# EAGLE design Tablero_Potencia (EAGLE 9.6.2)
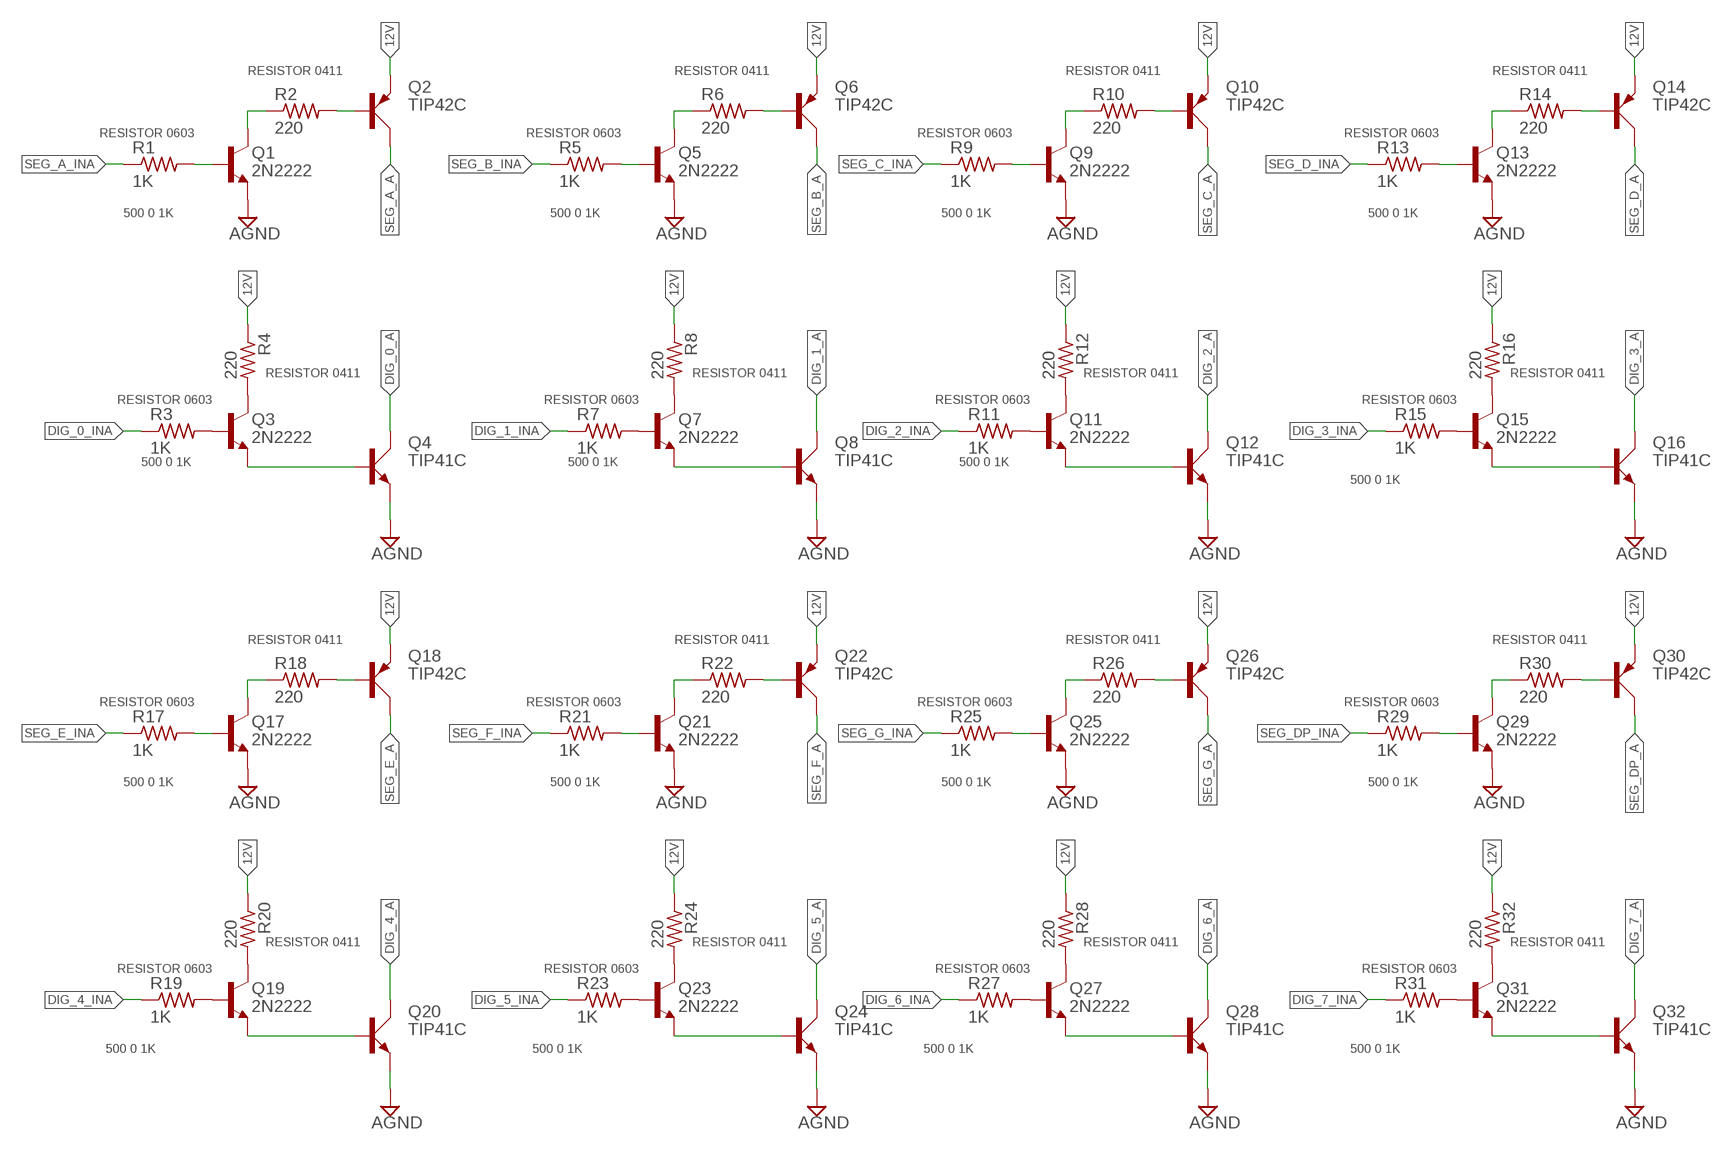
[diagram p0: schematic, sheet 1, part 1 of 2]
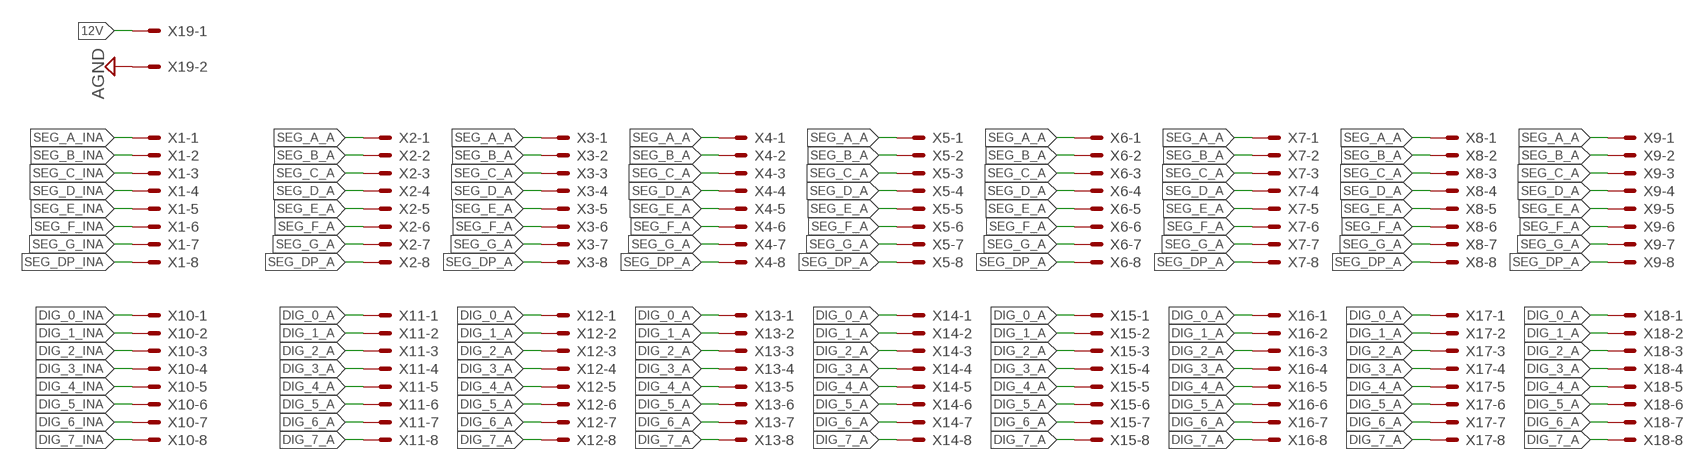
[diagram p1: schematic, sheet 1, part 2 of 2]

## Parts
Q1  2N2222  BJT-NPNTO92  [TO92]
Q2  TIP42C  [TO220AV]
Q3  2N2222  BJT-NPNTO92  [TO92]
Q4  TIP41C  [TO220AV]
Q5  2N2222  BJT-NPNTO92  [TO92]
Q6  TIP42C  [TO220AV]
Q7  2N2222  BJT-NPNTO92  [TO92]
Q8  TIP41C  [TO220AV]
Q9  2N2222  BJT-NPNTO92  [TO92]
Q10  TIP42C  [TO220AV]
Q11  2N2222  BJT-NPNTO92  [TO92]
Q12  TIP41C  [TO220AV]
Q13  2N2222  BJT-NPNTO92  [TO92]
Q14  TIP42C  [TO220AV]
Q15  2N2222  BJT-NPNTO92  [TO92]
Q16  TIP41C  [TO220AV]
Q17  2N2222  BJT-NPNTO92  [TO92]
Q18  TIP42C  [TO220AV]
Q19  2N2222  BJT-NPNTO92  [TO92]
Q20  TIP41C  [TO220AV]
Q21  2N2222  BJT-NPNTO92  [TO92]
Q22  TIP42C  [TO220AV]
Q23  2N2222  BJT-NPNTO92  [TO92]
Q24  TIP41C  [TO220AV]
Q25  2N2222  BJT-NPNTO92  [TO92]
Q26  TIP42C  [TO220AV]
Q27  2N2222  BJT-NPNTO92  [TO92]
Q28  TIP41C  [TO220AV]
Q29  2N2222  BJT-NPNTO92  [TO92]
Q30  TIP42C  [TO220AV]
Q31  2N2222  BJT-NPNTO92  [TO92]
Q32  TIP41C  [TO220AV]
R1  1K  R-US_R0603  [R0603]
R2  220  R-US_0411/15  [0411/15]
R3  1K  R-US_R0603  [R0603]
R4  220  R-US_0411/15  [0411/15]
R5  1K  R-US_R0603  [R0603]
R6  220  R-US_0411/15  [0411/15]
R7  1K  R-US_R0603  [R0603]
R8  220  R-US_0411/15  [0411/15]
R9  1K  R-US_R0603  [R0603]
R10  220  R-US_0411/15  [0411/15]
R11  1K  R-US_R0603  [R0603]
R12  220  R-US_0411/15  [0411/15]
R13  1K  R-US_R0603  [R0603]
R14  220  R-US_0411/15  [0411/15]
R15  1K  R-US_R0603  [R0603]
R16  220  R-US_0411/15  [0411/15]
R17  1K  R-US_R0603  [R0603]
R18  220  R-US_0411/15  [0411/15]
R19  1K  R-US_R0603  [R0603]
R20  220  R-US_0411/15  [0411/15]
R21  1K  R-US_R0603  [R0603]
R22  220  R-US_0411/15  [0411/15]
R23  1K  R-US_R0603  [R0603]
R24  220  R-US_0411/15  [0411/15]
R25  1K  R-US_R0603  [R0603]
R26  220  R-US_0411/15  [0411/15]
R27  1K  R-US_R0603  [R0603]
R28  220  R-US_0411/15  [0411/15]
R29  1K  R-US_R0603  [R0603]
R30  220  R-US_0411/15  [0411/15]
R31  1K  R-US_R0603  [R0603]
R32  220  R-US_0411/15  [0411/15]
X1  KK-156-8  [KK-156-8]
X2  KK-156-8  [KK-156-8]
X3  KK-156-8  [KK-156-8]
X4  KK-156-8  [KK-156-8]
X5  KK-156-8  [KK-156-8]
X6  KK-156-8  [KK-156-8]
X7  KK-156-8  [KK-156-8]
X8  KK-156-8  [KK-156-8]
X9  KK-156-8  [KK-156-8]
X10  KK-156-8  [KK-156-8]
X11  KK-156-8  [KK-156-8]
X12  KK-156-8  [KK-156-8]
X13  KK-156-8  [KK-156-8]
X14  KK-156-8  [KK-156-8]
X15  KK-156-8  [KK-156-8]
X16  KK-156-8  [KK-156-8]
X17  KK-156-8  [KK-156-8]
X18  KK-156-8  [KK-156-8]
X19  KK-156-2  [KK-156-2]

## Nets
12V [12VV]: Q2.E Q6.E Q10.E Q14.E Q18.E Q22.E Q26.E Q30.E R4.1 R8.1 R12.1 R16.1 R20.1 R24.1 R28.1 R32.1 X19.1
AGND: Q1.3(E) Q4.E Q5.3(E) Q8.E Q9.3(E) Q12.E Q13.3(E) Q16.E Q17.3(E) Q20.E Q21.3(E) Q24.E Q25.3(E) Q28.E Q29.3(E) Q32.E X19.2
DIG_0_A [12V]: Q4.C X11.1 X12.1 X13.1 X14.1 X15.1 X16.1 X17.1 X18.1
DIG_0_INA: R3.1 X10.1
DIG_1_A [12V]: Q8.C X11.2 X12.2 X13.2 X14.2 X15.2 X16.2 X17.2 X18.2
DIG_1_INA: R7.1 X10.2
DIG_2_A [12V]: Q12.C X11.3 X12.3 X13.3 X14.3 X15.3 X16.3 X17.3 X18.3
DIG_2_INA: R11.1 X10.3
DIG_3_A [12V]: Q16.C X11.4 X12.4 X13.4 X14.4 X15.4 X16.4 X17.4 X18.4
DIG_3_INA: R15.1 X10.4
DIG_4_A [12V]: Q20.C X11.5 X12.5 X13.5 X14.5 X15.5 X16.5 X17.5 X18.5
DIG_4_INA: R19.1 X10.5
DIG_5_A [12V]: Q24.C X11.6 X12.6 X13.6 X14.6 X15.6 X16.6 X17.6 X18.6
DIG_5_INA: R23.1 X10.6
DIG_6_A [12V]: Q28.C X11.7 X12.7 X13.7 X14.7 X15.7 X16.7 X17.7 X18.7
DIG_6_INA: R27.1 X10.7
DIG_7_A [12V]: Q32.C X11.8 X12.8 X13.8 X14.8 X15.8 X16.8 X17.8 X18.8
DIG_7_INA: R31.1 X10.8
N$1: Q2.B R2.2
N$2: Q1.1(C) R2.1
N$3: Q3.1(C) R4.2
N$4: Q3.3(E) Q4.B
N$5: Q6.B R6.2
N$6: Q7.1(C) R8.2
N$7: Q7.3(E) Q8.B
N$8: Q5.1(C) R6.1
N$9: Q7.2(B) R7.2
N$10: Q5.2(B) R5.2
N$11: Q3.2(B) R3.2
N$12: Q1.2(B) R1.2
N$13: Q10.B R10.2
N$14: Q11.1(C) R12.2
N$15: Q11.3(E) Q12.B
N$16: Q9.1(C) R10.1
N$17: Q11.2(B) R11.2
N$18: Q9.2(B) R9.2
N$19: Q14.B R14.2
N$20: Q15.1(C) R16.2
N$21: Q15.3(E) Q16.B
N$22: Q13.1(C) R14.1
N$23: Q15.2(B) R15.2
N$24: Q13.2(B) R13.2
N$25: Q18.B R18.2
N$26: Q19.1(C) R20.2
N$27: Q19.3(E) Q20.B
N$28: Q17.1(C) R18.1
N$29: Q19.2(B) R19.2
N$30: Q17.2(B) R17.2
N$31: Q22.B R22.2
N$32: Q23.1(C) R24.2
N$33: Q23.3(E) Q24.B
N$34: Q21.1(C) R22.1
N$35: Q23.2(B) R23.2
N$36: Q21.2(B) R21.2
N$37: Q26.B R26.2
N$38: Q27.1(C) R28.2
N$39: Q27.3(E) Q28.B
N$40: Q25.1(C) R26.1
N$41: Q27.2(B) R27.2
N$42: Q25.2(B) R25.2
N$43: Q30.B R30.2
N$44: Q31.1(C) R32.2
N$45: Q31.3(E) Q32.B
N$46: Q29.1(C) R30.1
N$47: Q31.2(B) R31.2
N$48: Q29.2(B) R29.2
SEG_A_A [12V]: Q2.C X2.1 X3.1 X4.1 X5.1 X6.1 X7.1 X8.1 X9.1
SEG_A_INA: R1.1 X1.1
SEG_B_A [12V]: Q6.C X2.2 X3.2 X4.2 X5.2 X6.2 X7.2 X8.2 X9.2
SEG_B_INA: R5.1 X1.2
SEG_C_A [12V]: Q10.C X2.3 X3.3 X4.3 X5.3 X6.3 X7.3 X8.3 X9.3
SEG_C_INA: R9.1 X1.3
SEG_D_A [12V]: Q14.C X2.4 X3.4 X4.4 X5.4 X6.4 X7.4 X8.4 X9.4
SEG_D_INA: R13.1 X1.4
SEG_DP_A [12V]: Q30.C X2.8 X3.8 X4.8 X5.8 X6.8 X7.8 X8.8 X9.8
SEG_DP_INA: R29.1 X1.8
SEG_E_A [12V]: Q18.C X2.5 X3.5 X4.5 X5.5 X6.5 X7.5 X8.5 X9.5
SEG_E_INA: R17.1 X1.5
SEG_F_A [12V]: Q22.C X2.6 X3.6 X4.6 X5.6 X6.6 X7.6 X8.6 X9.6
SEG_F_INA: R21.1 X1.6
SEG_G_A [12V]: Q26.C X2.7 X3.7 X4.7 X5.7 X6.7 X7.7 X8.7 X9.7
SEG_G_INA: R25.1 X1.7

## Notes on the sheet
- RESISTOR 0411 | RESISTOR 0411 | RESISTOR 0411 | RESISTOR 0411
- RESISTOR 0603 | RESISTOR 0603 | RESISTOR 0603 | RESISTOR 0603
- 500 0 1K | 500 0 1K | 500 0 1K | 500 0 1K
- RESISTOR 0411 | RESISTOR 0411 | RESISTOR 0411 | RESISTOR 0411
- RESISTOR 0603 | RESISTOR 0603 | RESISTOR 0603 | RESISTOR 0603
- 500 0 1K | 500 0 1K | 500 0 1K
- 500 0 1K
- RESISTOR 0411 | RESISTOR 0411 | RESISTOR 0411 | RESISTOR 0411
- RESISTOR 0603 | RESISTOR 0603 | RESISTOR 0603 | RESISTOR 0603
- 500 0 1K | 500 0 1K | 500 0 1K | 500 0 1K
- RESISTOR 0411 | RESISTOR 0411 | RESISTOR 0411 | RESISTOR 0411
- RESISTOR 0603 | RESISTOR 0603 | RESISTOR 0603 | RESISTOR 0603
- 500 0 1K | 500 0 1K | 500 0 1K | 500 0 1K

## Library data of the parts
Q1 Q3 Q5 Q7 Q9 Q11 Q13 Q15 Q17 Q19 Q21 Q23 Q25 Q27 Q29 Q31 = bt_transistor:BJT-NPN: NPN Transistor Small signal NPN Bipolar Junction Transistor (BJT). Use this device to represent any of a number of such transistors with similar package and pinout: 2N4401, 2N3904, 2N2222, etc.
Q2 Q6 Q10 Q14 Q18 Q22 Q26 Q30 = transistor-power:TIP42C: PNP TRANSISTOR
Q4 Q8 Q12 Q16 Q20 Q24 Q28 Q32 = transistor-power:TIP41C: NPN TRANSISTOR
R1-R32 = rcl:R-US_: RESISTOR, American symbol; SPICEPREFIX: R
X1-X18 = con-molex:KK-156-8: KK 156 HEADER Source: http://www.molex.com/pdm_docs/sd/026604100_sd.pdf; MF: MOLEX; OC_FARNELL: unknown; OC_NEWARK: unknown
X19 = con-molex:KK-156-2: KK 156 HEADER Source: http://www.molex.com/pdm_docs/sd/026604100_sd.pdf; MF: MOLEX; OC_FARNELL: unknown; OC_NEWARK: unknown

## Net classes
0 default: width 0.3 mm, clearance 0.205 mm
1 12V: width 0.7 mm, clearance 0.5 mm
2 12VV: width 1 mm, clearance 0.45 mm

## Board
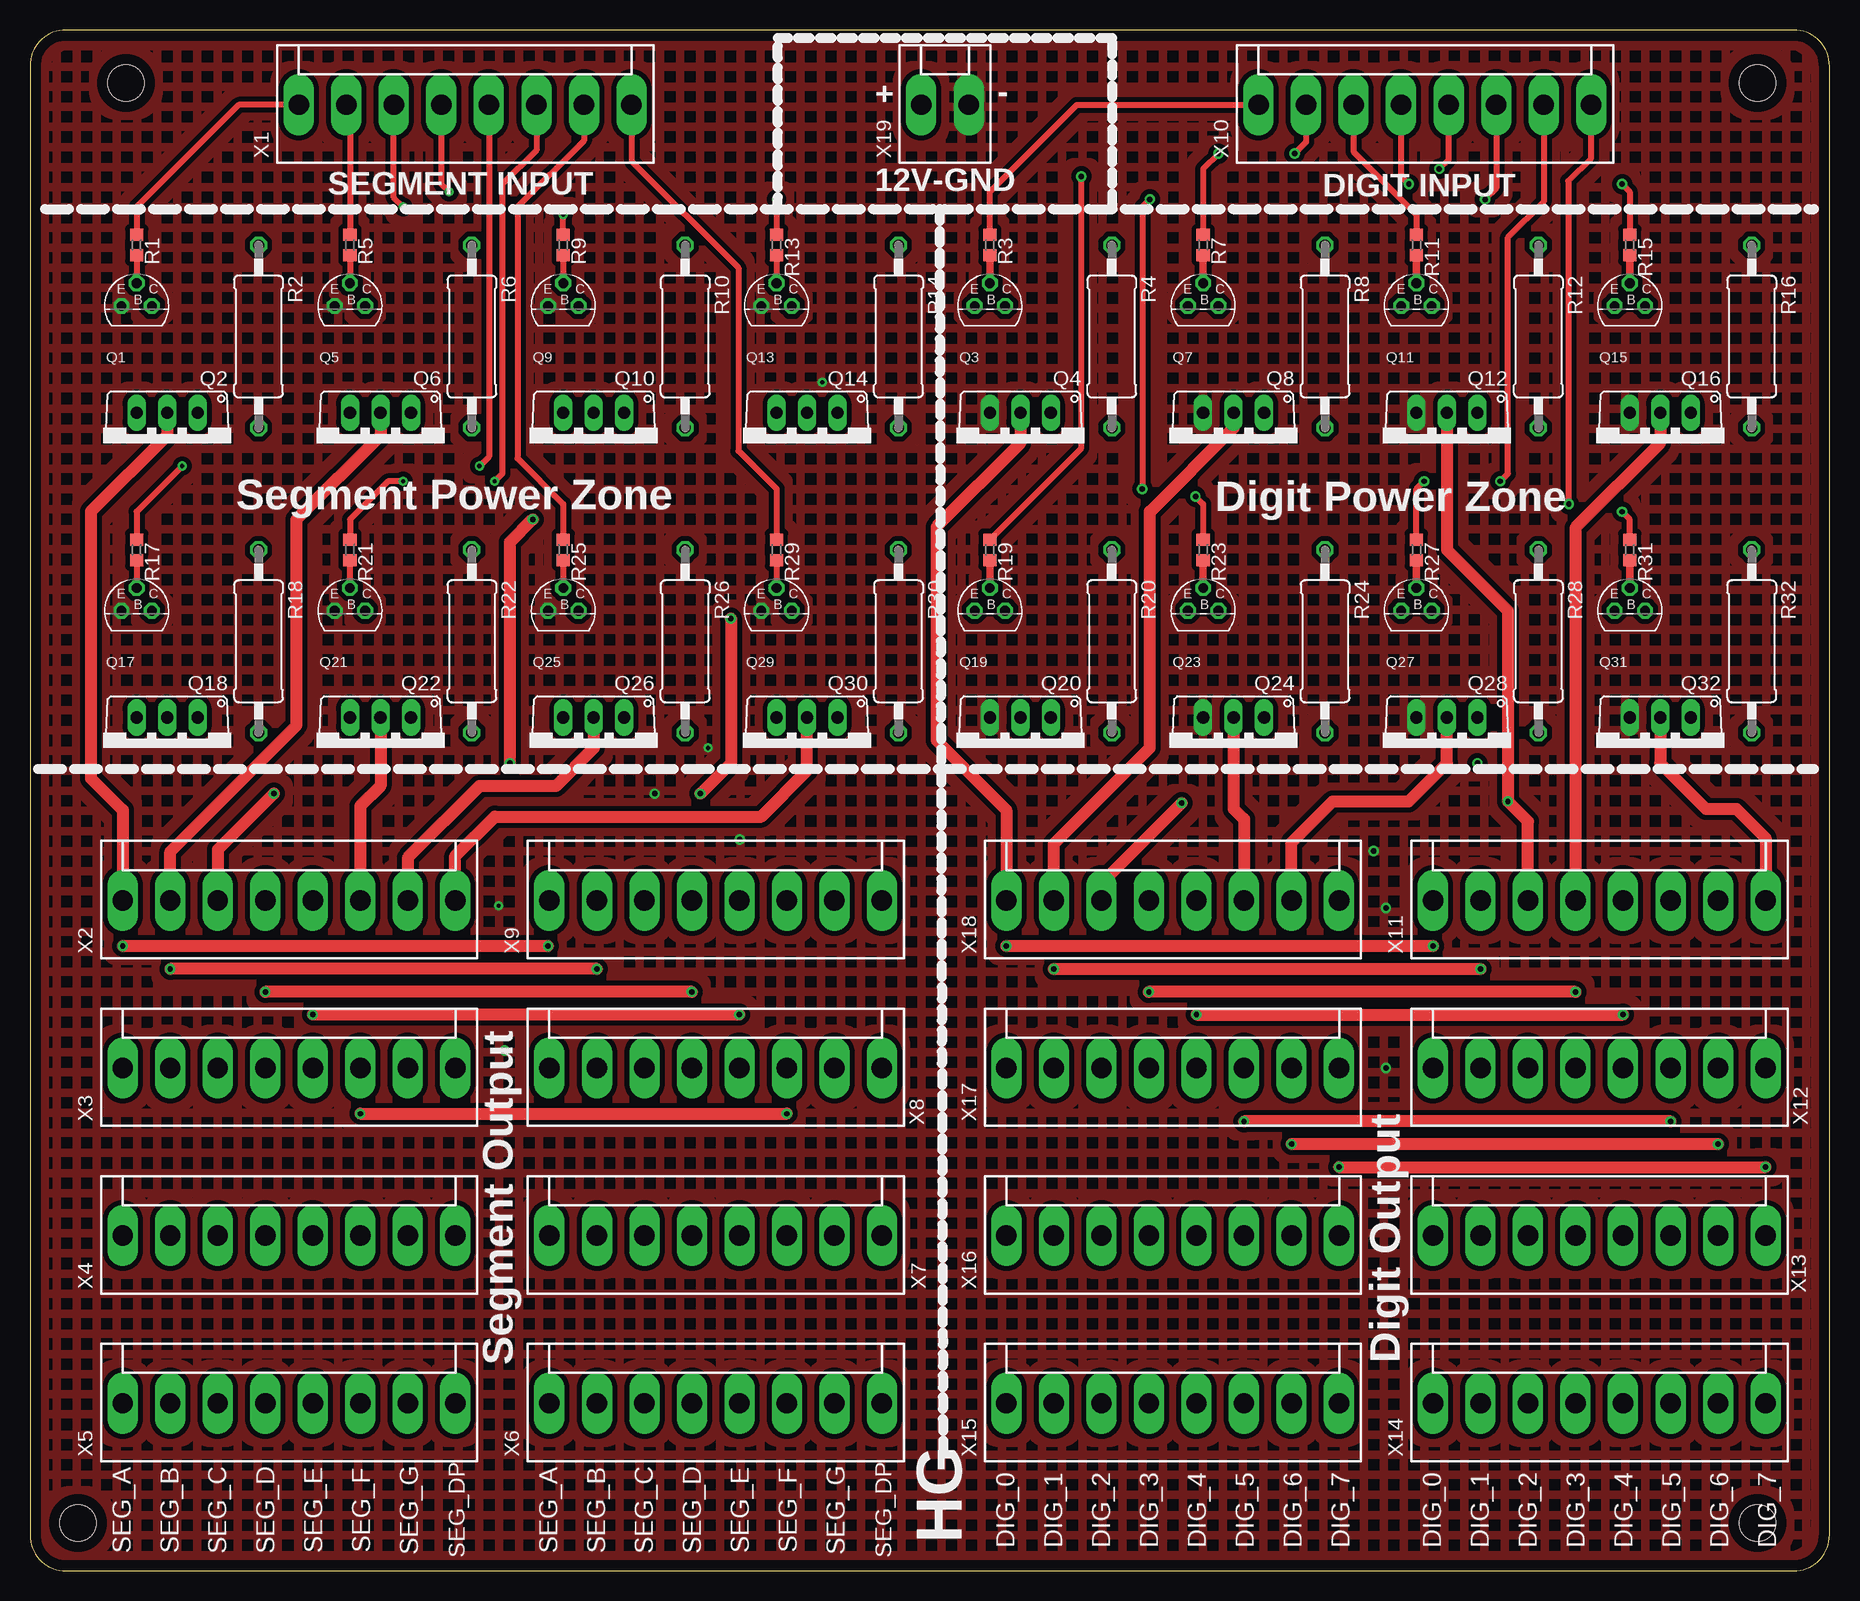
[diagram p2: board, top side]
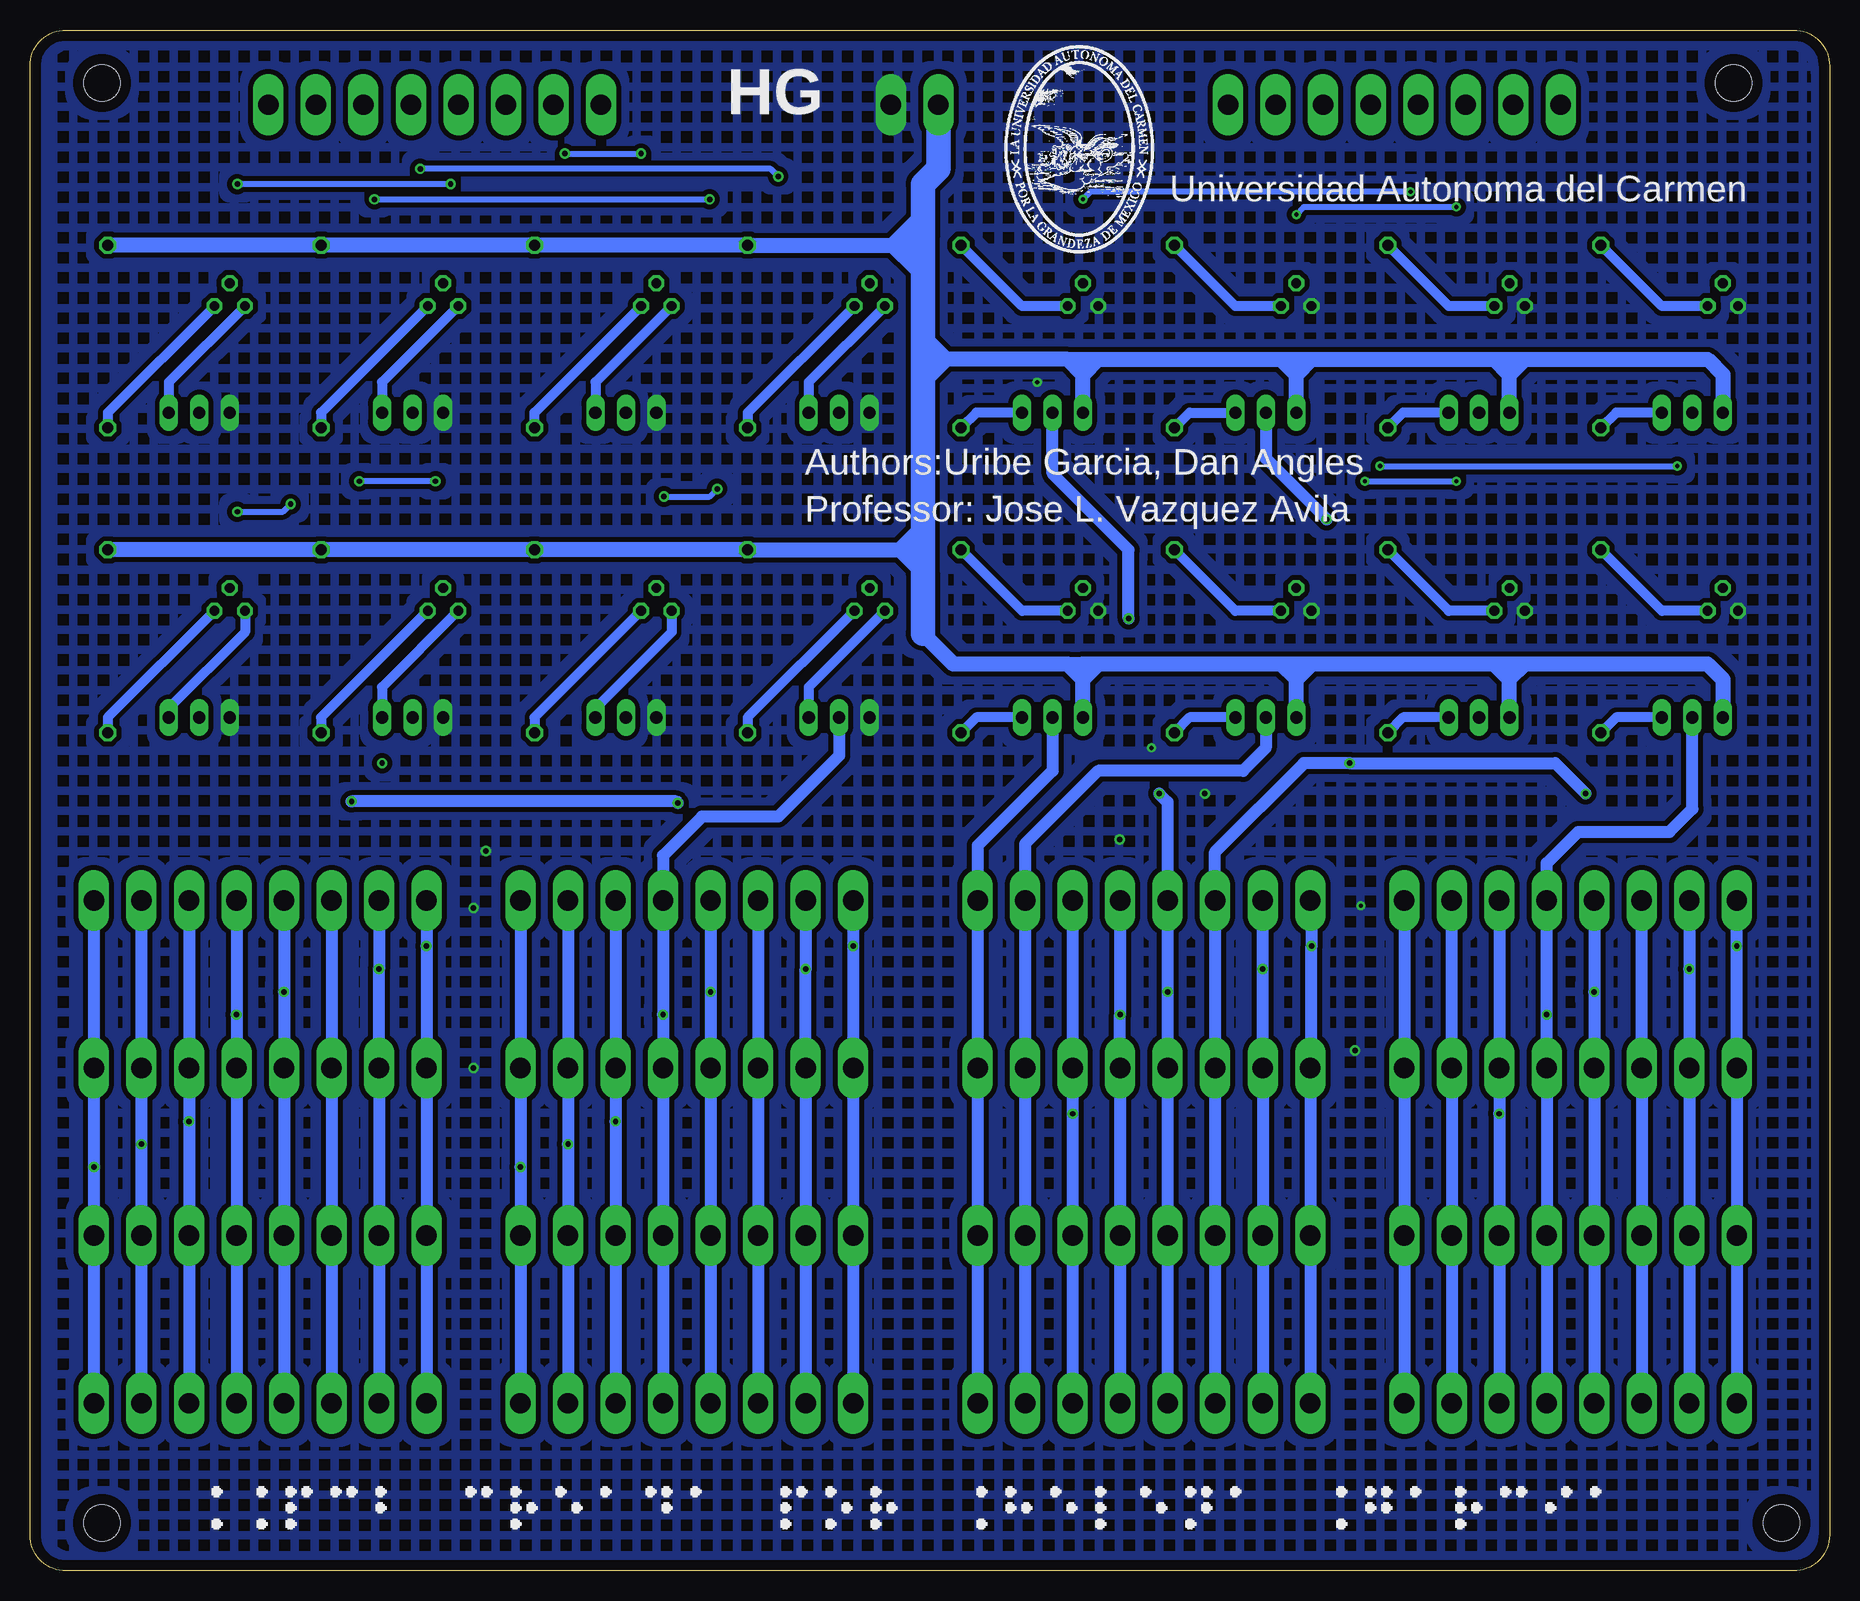
[diagram p3: board, bottom side, seen from below]

Size 150 x 128.41 mm. Coordinates in mm from the lower left corner, seen from the top.
Outline: 0,125.41 0,3 arc90 3,0 147,0 arc90 150,3 150,125.41 arc90 147,128.41 3,128.41 arc90 0,125.41
Copper layers (1*16): Top 0.035mm / dielectric 1.5mm / Bottom 0.035mm
Design rules "default *": minimum track width 8mil, minimum drill 0.35mm, track to track 5mil, track to pad 6mil, pad to pad 6mil, via to via 6mil, smd to smd 6mil, copper to edge 35mil, drill to drill 6mil, minimum pad ring 10mil, minimum via ring 8mil, stop-mask expansion 4mil, vias tented up to drill 0mil, thermal gap 10mil
Holes 3 mm at 144,124 8,124 4,4 144,4

### Footprints (pad centres in the part's own frame; a part is rotated, then mirrored left to right if it is on the bottom)
TO92 = drill 0.813 octagon: 1 1.27,0; 2 0,1.905; 3 -1.27,0
TO220AV = drill 1.016 long: B -2.54,-2.54; C 0,-2.54; E 2.54,-2.54
R0603 = smd 1 x 1.1: 1 -0.85,0; 2 0.85,0
0411/15 = drill 0.914 octagon: 1 -7.62,0; 2 7.62,0
KK-156-8 = drill 1.7 pad 2.184 long: 1 -13.86,0; 2 -9.9,0; 3 -5.94,0; 4 -1.98,0; 5 1.98,0; 6 5.94,0; 7 9.9,0; 8 13.86,0
KK-156-2 = drill 1.7 pad 2.184 long: 1 -1.98,0; 2 1.98,0

### Placement (x,y rotation side)
Q1  8.89,105.41 0 top
Q2  11.43,93.98 180 top
Q3  80.01,105.41 0 top
Q4  82.55,93.98 180 top
Q5  26.67,105.41 0 top
Q6  29.21,93.98 180 top
Q7  97.79,105.41 0 top
Q8  100.33,93.98 180 top
Q9  44.45,105.41 0 top
Q10  46.99,93.98 180 top
Q11  115.57,105.41 0 top
Q12  118.11,93.98 180 top
Q13  62.23,105.41 0 top
Q14  64.77,93.98 180 top
Q15  133.35,105.41 0 top
Q16  135.89,93.98 180 top
Q17  8.89,80.01 0 top
Q18  11.43,68.58 180 top
Q19  80.01,80.01 0 top
Q20  82.55,68.58 180 top
Q21  26.67,80.01 0 top
Q22  29.21,68.58 180 top
Q23  97.79,80.01 0 top
Q24  100.33,68.58 180 top
Q25  44.45,80.01 0 top
Q26  46.99,68.58 180 top
Q27  115.57,80.01 0 top
Q28  118.11,68.58 180 top
Q29  62.23,80.01 0 top
Q30  64.77,68.58 180 top
Q31  133.35,80.01 0 top
Q32  135.89,68.58 180 top
R1  8.89,110.49 270 top
R2  19.05,102.87 270 top
R3  80.01,110.49 270 top
R4  90.17,102.87 270 top
R5  26.67,110.49 270 top
R6  36.83,102.87 270 top
R7  97.79,110.49 270 top
R8  107.95,102.87 270 top
R9  44.45,110.49 270 top
R10  54.61,102.87 270 top
R11  115.57,110.49 270 top
R12  125.73,102.87 270 top
R13  62.23,110.49 270 top
R14  72.39,102.87 270 top
R15  133.35,110.49 270 top
R16  143.51,102.87 270 top
R17  8.89,85.09 270 top
R18  19.05,77.47 270 top
R19  80.01,85.09 270 top
R20  90.17,77.47 270 top
R21  26.67,85.09 270 top
R22  36.83,77.47 270 top
R23  97.79,85.09 270 top
R24  107.95,77.47 270 top
R25  44.45,85.09 270 top
R26  54.61,77.47 270 top
R27  115.57,85.09 270 top
R28  125.73,77.47 270 top
R29  62.23,85.09 270 top
R30  72.39,77.47 270 top
R31  133.35,85.09 270 top
R32  143.51,77.47 270 top
X1  36.27,122.18 0 top
X2  21.59,55.88 0 top
X3  21.59,41.91 0 top
X4  21.59,27.94 0 top
X5  21.59,13.97 0 top
X6  57.15,13.97 0 top
X7  57.15,27.94 0 top
X8  57.15,41.91 0 top
X9  57.15,55.88 0 top
X10  116.27,122.18 0 top
X11  130.81,55.88 0 top
X12  130.81,41.91 0 top
X13  130.81,27.94 0 top
X14  130.81,13.97 0 top
X15  95.25,13.97 0 top
X16  95.25,27.94 0 top
X17  95.25,41.91 0 top
X18  95.25,55.88 0 top
X19  76.27,122.18 0 top

### Tracks (layer width: path | path; a pad name or v marks a point on that pad's centre or on a via)
12V
  Bottom 1.27: 78.1,110.49 R4.1 R8.1 R12.1 R16.1 | 78.1,110.49 76.2,110.49 75.56,111.12 | 75.56,112.39 76.2,112.39 78.1,110.49 | 78.1,110.49 76.2,108.58 75.56,108.58 | 75.56,100.96 73.66,100.96 | 63.5,100.96 73.66,100.96 | 63.5,100.96 62.23,100.96 | 62.23,100.96 60.96,100.96 | 60.96,100.96 45.72,100.96 | 45.72,100.96 44.45,100.96 | 44.45,100.96 43.18,100.96 | 43.18,100.96 27.94,100.96 | 27.94,100.96 26.67,100.96 | 26.67,100.96 25.4,100.96 | 25.4,100.96 10.16,100.96 8.89,99.69 Q2.E | Q6.E 26.67,99.69 | 26.67,99.69 26.67,100.96 | 25.4,100.96 26.67,99.69 | 26.67,99.69 27.94,100.96 | 44.45,100.96 44.45,99.69 | Q10.E 44.45,99.69 | 43.18,100.96 44.45,99.69 | 44.45,99.69 45.72,100.96 | Q14.E 62.23,99.69 | 62.23,100.96 62.23,99.69 | 60.96,100.96 62.23,99.69 | 62.23,99.69 63.5,100.96 | 73.66,100.96 75.56,99.06 | 73.66,100.96 75.56,102.87 75.56,103.5 | 77.47,85.09 R20.1 R24.1 R28.1 R32.1 | 75.56,85.09 77.47,85.09 | 75.56,86.99 77.47,85.09 | 77.47,85.09 75.56,83.19 | Q18.E 8.89,74.3 10.16,75.56 25.4,75.56 | 25.4,75.56 26.67,75.56 | 26.67,75.56 27.94,75.56 | 27.94,75.56 43.18,75.56 | 43.18,75.56 44.45,75.56 | 44.45,75.56 45.72,75.56 | 45.72,75.56 60.96,75.56 | 60.96,75.56 62.23,75.56 | 63.5,75.56 62.23,75.56 | 63.5,75.56 73.02,75.56 75.56,78.1 | Q30.E 62.23,74.3 | 62.23,75.56 62.23,74.3 | 60.96,75.56 62.23,74.3 | 62.23,74.3 63.5,75.56 | Q26.E 44.45,74.3 | 44.45,75.56 44.45,74.3 | 43.18,75.56 44.45,74.3 | 44.45,74.3 45.72,75.56 | Q22.E 26.67,74.3 | 26.67,75.56 26.67,74.3 | 25.4,75.56 26.67,74.3 | 26.67,74.3 27.94,75.56
  Bottom 2.032: X19.1 74.29,116.84 75.56,115.57 75.56,112.39 75.56,111.12 75.56,108.58 75.56,103.5 75.56,100.96 75.56,99.06 75.56,86.99 75.56,85.09 75.56,83.19 75.56,78.1
AGND  (via drill 0.35, 0.45)
  other vias: 112,60 113.03,41.91 113.03,55.25 39.55,43.37 52.07,64.77 59.17,60.96 56.52,68.58 66.04,99.06 39.06,55.43
  pour Bottom (isolate 0.406, no thermals, hatched): -20,148 184,148 168,132 168,-8 164,-12 -20,-12
  pour Top (isolate 0.406, no thermals, hatched): -4,136 152,136 168,120 168,0 160,-8 8,-8 -20,20 -20,120
DIG_0_A  (via drill 0.45)
  Top 1.016: Q4.C 82.55,93.98 75.56,86.99 75.56,69.21 81.39,63.39 X18.1 | v116.95,52.07 v81.39,52.07
  Bottom 1.016: X18.1 v81.39,52.07 X17.1 X16.1 X15.1 | X11.1 v116.95,52.07 X12.1 X13.1 X14.1
DIG_0_INA
  Top 0.508: R3.1 80.01,114.94 87.25,122.18 X10.1
DIG_1_A  (via drill 0.45)
  Top 1.016: Q8.C 100.33,95.25 93.34,88.27 93.34,68.58 85.35,60.59 X18.2 | v85.35,50.16 v120.91,50.16
  Bottom 1.016: X15.2 X16.2 X17.2 v85.35,50.16 X18.2 | X11.2 v120.91,50.16 X12.2 X13.2 X14.2
DIG_1_INA  (via drill 0.45)
  Top 0.508: X10.2 106.37,119.07 v105.41,118.11 | v99.06,118.11 97.79,116.84 R7.1
  Bottom 0.508: v105.41,118.11 v99.06,118.11
DIG_2_A  (via drill 0.45)
  Top 1.016: Q12.C 118.11,85.09 123.19,80.01 v123.19,64.13 124.87,62.46 X11.3 | X18.3 89.31,57.31 v96,64
  Bottom 1.016: X18.3 X17.3 X16.3 X15.3 | X11.3 X12.3 X13.3 X14.3 | v96,64 96.13,64.13 v123.19,64.13
DIG_2_INA
  Top 0.508: X10.3 110.33,118.27 115.57,113.03 R11.1
DIG_3_A  (via drill 0.45)
  Top 1.016: Q16.C 135.89,93.98 128.83,86.92 X11.4 | v128.83,48.26 v93.27,48.26
  Bottom 1.016: X18.4 v93.27,48.26 X17.4 X16.4 X15.4 | X11.4 v128.83,48.26 X12.4 X13.4 X14.4
DIG_3_INA  (via drill 0.45)
  Top 0.508: X10.4 114.29,116.21 v114.93,115.57 | v132.71,115.57 133.35,114.94 R15.1
  Bottom 0.508: v114.93,115.57 v132.71,115.57
DIG_4_A  (via drill 0.45)
  Top 1.016: v97.23,46.36 v132.79,46.36
  Bottom 1.016: X15.5 X16.5 X17.5 v97.23,46.36 X18.5 97.23,59.62 93.98,62.87 87.63,62.87 82.55,67.94 Q20.C | X11.5 v132.79,46.36 X12.5 X13.5 X14.5
DIG_4_INA  (via drill 0.45)
  Top 0.508: R19.1 87.63,93.56 v87.63,116.2 | v117.47,116.84 118.25,117.61 X10.5
  Bottom 0.508: v87.63,116.2 88.26,116.84 v117.47,116.84
DIG_5_A  (via drill 0.45)
  Top 1.016: Q24.C 100.33,63.5 101.19,62.64 X18.6 | v136.75,37.47 v101.19,37.47
  Bottom 1.016: X18.6 X17.6 v101.19,37.47 X16.6 X15.6 | X11.6 X12.6 v136.75,37.47 X13.6 X14.6
DIG_5_INA  (via drill 0.45)
  Top 0.508: X10.6 122.21,115.22 v121.28,114.3 | v93.34,114.3 92.71,113.66 v92.71,90.17 | R23.1 97.79,88.9 v97.15,89.53
  Bottom 0.508: v121.28,114.3 v93.34,114.3 | v97.15,89.53 93.34,89.53 v92.71,90.17
DIG_6_A  (via drill 0.45)
  Top 1.016: X18.7 105.15,60.7 108.58,64.13 114.93,64.13 118.11,67.31 Q28.C | v140.71,35.56 v105.15,35.56
  Bottom 1.016: X18.7 X17.7 v105.15,35.56 X16.7 X15.7 | X11.7 X12.7 v140.71,35.56 X13.7 X14.7
DIG_6_INA  (via drill 0.45)
  Top 0.508: X10.7 126.17,114.1 123.19,111.12 123.19,91.44 v122.55,90.8 | R27.1 115.57,90.17 v116.2,90.8
  Bottom 0.508: v116.2,90.8 v122.55,90.8
DIG_7_A  (via drill 0.45)
  Top 1.016: Q32.C 135.89,67.31 139.7,63.5 142.24,63.5 144.67,61.07 X11.8 | v109.11,33.66 v144.67,33.66
  Bottom 1.016: X18.8 X17.8 v109.11,33.66 X16.8 X15.8 | X11.8 X12.8 v144.67,33.66 X13.8 X14.8
DIG_7_INA  (via drill 0.45)
  Top 0.508: R31.1 133.35,87.63 v132.71,88.27 | v128.27,88.9 128.22,88.94 128.22,115.83 130.13,117.73 X10.8
  Bottom 0.508: v132.71,88.27 128.9,88.27 v128.27,88.9
N$1
  Bottom 0.813: Q2.B 17.78,96.52 R2.2
N$2
  Bottom 0.813: Q1.1 13.97,105.41 R2.1
N$3
  Bottom 0.813: Q3.1 90.17,96.52 R4.2
N$4
  Bottom 0.813: Q3.3 85.09,99.06 Q4.B
N$5
  Bottom 0.813: Q6.B 35.56,96.52 R6.2
N$6
  Bottom 0.813: R8.2 107.95,96.52 Q7.1
N$7
  Bottom 0.813: Q7.3 102.87,99.06 Q8.B
N$8
  Bottom 0.813: Q5.1 31.75,105.41 R6.1
N$9
  Top 0.61: R7.2 Q7.2
N$10
  Top 0.508: R5.2 Q5.2
N$11
  Top 0.61: R3.2 Q3.2
N$12
  Top 0.508: R1.2 | R1.2 Q1.2
N$13
  Bottom 0.813: R10.2 53.34,96.52 Q10.B
N$14
  Bottom 0.813: Q11.1 125.73,96.52 R12.2
N$15
  Bottom 0.813: Q11.3 120.65,99.06 Q12.B
N$16
  Bottom 0.813: Q9.1 49.53,105.41 R10.1
N$17
  Top 0.61: R11.2 Q11.2
N$18
  Top 0.508: R9.2 Q9.2
N$19
  Bottom 0.813: Q14.B 71.12,96.52 R14.2
N$20
  Bottom 0.813: Q15.1 143.51,96.52 R16.2
N$21
  Bottom 0.813: Q15.3 138.43,99.06 Q16.B
N$22
  Bottom 0.813: Q13.1 67.31,105.41 R14.1
N$23
  Top 0.61: R15.2 Q15.2
N$24
  Top 0.508: R13.2 Q13.2
N$25
  Bottom 0.813: Q18.B 17.78,71.12 R18.2
N$26
  Bottom 0.813: R20.2 90.17,71.12 Q19.1
N$27
  Bottom 0.813: Q19.3 85.09,73.66 Q20.B
N$28
  Bottom 0.813: Q17.1 13.97,80.01 R18.1
N$29
  Top 0.61: R19.2 Q19.2
N$30
  Top 0.508: R17.2 Q17.2
N$31
  Bottom 0.813: Q22.B 35.56,71.12 R22.2
N$32
  Bottom 0.813: R24.2 107.95,71.12 Q23.1
N$33
  Bottom 0.813: Q24.B 102.87,71.88 96.52,78.23 Q23.3
N$34
  Bottom 0.813: Q21.1 31.75,80.01 R22.1
N$35
  Top 0.61: R23.2 Q23.2
N$36
  Top 0.508: Q21.2 R21.2
N$37
  Bottom 0.813: Q26.B 53.34,71.12 R26.2
N$38
  Bottom 0.813: R28.2 125.73,71.12 Q27.1
N$39
  Bottom 0.813: Q27.3 120.65,73.66 Q28.B
N$40
  Bottom 0.813: Q25.1 49.53,80.01 R26.1
N$41
  Top 0.61: R27.2 Q27.2
N$42
  Top 0.508: R25.2 Q25.2
N$43
  Bottom 0.813: Q30.B 71.12,71.12 R30.2
N$44
  Bottom 0.813: R32.2 143.51,71.12 Q31.1
N$45
  Bottom 0.813: Q32.B 138.43,71.88 132.08,78.23 Q31.3
N$46
  Bottom 0.813: Q29.1 67.31,80.01 R30.1
N$47
  Top 0.61: R31.2 Q31.2
N$48
  Top 0.508: R29.2 Q29.2
N$50  (via drill 0.45)
  other vias: 120.65,67.31
SEG_A_A  (via drill 0.45)
  Top 1.016: Q2.C 11.43,94.61 5.08,88.27 5.08,66.04 7.73,63.39 X2.1 | v43.18,52.07 v7.73,52.07
  Bottom 1.016: X9.1 43.18,55.77 v43.18,52.07 43.18,42.02 X8.1 X7.1 X6.1 | X2.1 v7.73,52.07 X3.1 X4.1 X5.1
SEG_A_INA
  Top 0.508: X1.1 17.4,122.18 8.89,113.66 R1.1
SEG_B_A  (via drill 0.45)
  Top 1.016: X2.2 11.69,59.95 22.22,70.48 22.22,87.63 29.21,94.61 Q6.C | v47.25,50.16 v11.69,50.16
  Bottom 1.016: X9.2 v47.25,50.16 X8.2 X7.2 X6.2 | X2.2 v11.69,50.16 X3.2 X4.2 X5.2
SEG_B_INA
  Top 0.508: X1.2 26.67,121.88 R5.1
SEG_C_A  (via drill 0.45)
  Top 1.016: v40,67.31 40,85.72 v41.91,87.63 | v20.32,64.77 15.65,60.1 X2.3
  Bottom 1.016: Q10.C 46.99,92.71 v41.91,87.63 | v20.32,64.77 22.86,67.31 v40,67.31 43.81,67.31 51.21,59.91 X9.3 X8.3 X7.3 X6.3 | X2.3 X3.3 X4.3 X5.3
SEG_C_INA  (via drill 0.35)
  Top 0.508: R9.1 v44.45,113.03 | X1.3 30.33,114.45 v31.11,113.66
  Bottom 0.508: v44.45,113.03 43.81,113.66 v31.11,113.66
SEG_D_A  (via drill 0.45)
  Top 1.016: v55.88,64.77 58.42,67.31 v58.42,79.38 | v55.17,48.26 v19.61,48.26
  Bottom 1.016: v58.42,79.38 58.42,85.09 64.77,91.44 Q14.C | v55.88,64.77 55.17,64.06 X9.4 v55.17,48.26 X8.4 X7.4 X6.4 | X2.4 v19.61,48.26 X3.4 X4.4 X5.4
SEG_D_INA  (via drill 0.35)
  Top 0.508: X1.4 34.29,115.57 v34.92,114.94 | v62.23,114.3 R13.1
  Bottom 0.508: v34.92,114.94 61.59,114.94 v62.23,114.3
SEG_DP_A
  Top 1.016: X2.8 35.45,59.58 38.73,62.87 60.96,62.87 64.77,66.67 Q30.C
  Bottom 1.016: Q30.C 64.77,66.67 71.01,60.44 X9.8 X8.8 X7.8 X6.8 | X2.8 X3.8 X4.8 X5.8
SEG_DP_INA
  Top 0.508: R29.1 62.23,90.17 59.05,93.34 59.05,108.58 50.16,117.47 50.16,122.14 X1.8
SEG_E_A  (via drill 0.45)
  Top 1.016: v59.13,46.36 v23.57,46.36
  Bottom 1.016: Q18.C 11.43,63.5 13.33,61.6 20.95,61.6 23.57,58.98 X2.5 v23.57,46.36 X3.5 X4.5 X5.5 | X9.5 v59.13,46.36 X8.5 X7.5 X6.5
SEG_E_INA  (via drill 0.35)
  Top 0.508: X1.5 38.25,92.86 v37.46,92.07 | v12.7,92.07 8.89,88.27 R17.1
  Bottom 0.508: v37.46,92.07 v12.7,92.07
SEG_F_A  (via drill 0.45)
  Top 1.016: Q22.C 29.21,65.41 27.53,63.73 X2.6 | v27.53,38.1 v63.09,38.1
  Bottom 1.016: X9.6 X8.6 v63.09,38.1 X7.6 X6.6 | X2.6 X3.6 v27.53,38.1 X4.6 X5.6
SEG_F_INA  (via drill 0.35)
  Top 0.508: X1.6 42.21,118.41 39.37,115.57 39.37,91.44 v38.73,90.8 | v31.11,90.8 29.84,90.8 26.67,87.63 R21.1
  Bottom 0.508: v38.73,90.8 v31.11,90.8
SEG_G_A
  Top 1.016: Q26.C 46.99,68.58 43.81,65.41 37.46,65.41 31.49,59.43 X2.7
  Bottom 1.016: Q26.C 46.99,68.58 48.89,66.67 60.96,66.67 67.05,60.59 X9.7 X8.7 X7.7 X6.7 | X2.7 X3.7 X4.7 X5.7
SEG_G_INA
  Top 0.508: X1.7 46.17,119.19 40.64,113.66 40.64,92.71 44.45,88.9 R25.1

### Text on the board
tPlace: + | - | SEGMENT INPUT | 12V-GND | DIGIT INPUT | Segment Power Zone | Digit Power Zone | Segment Output | Digit Output | SEG_A | SEG_B | SEG_C | SEG_D | SEG_E | SEG_F | SEG_G | SEG_DP | SEG_A | SEG_B | SEG_C | SEG_D | SEG_E | SEG_F | SEG_G | SEG_DP | DIG_0 | DIG_1 | DIG_2 | DIG_3 | DIG_4 | DIG_5 | DIG_6 | DIG_7 | DIG_0 | DIG_1 | DIG_2 | DIG_3 | DIG_4 | DIG_5 | DIG_6 | DIG_7 | HG
bPlace: HG | Universidad Autonoma del Carmen | Authors:Uribe Garcia, Dan Angles | Professor: Jose L. Vazquez Avila